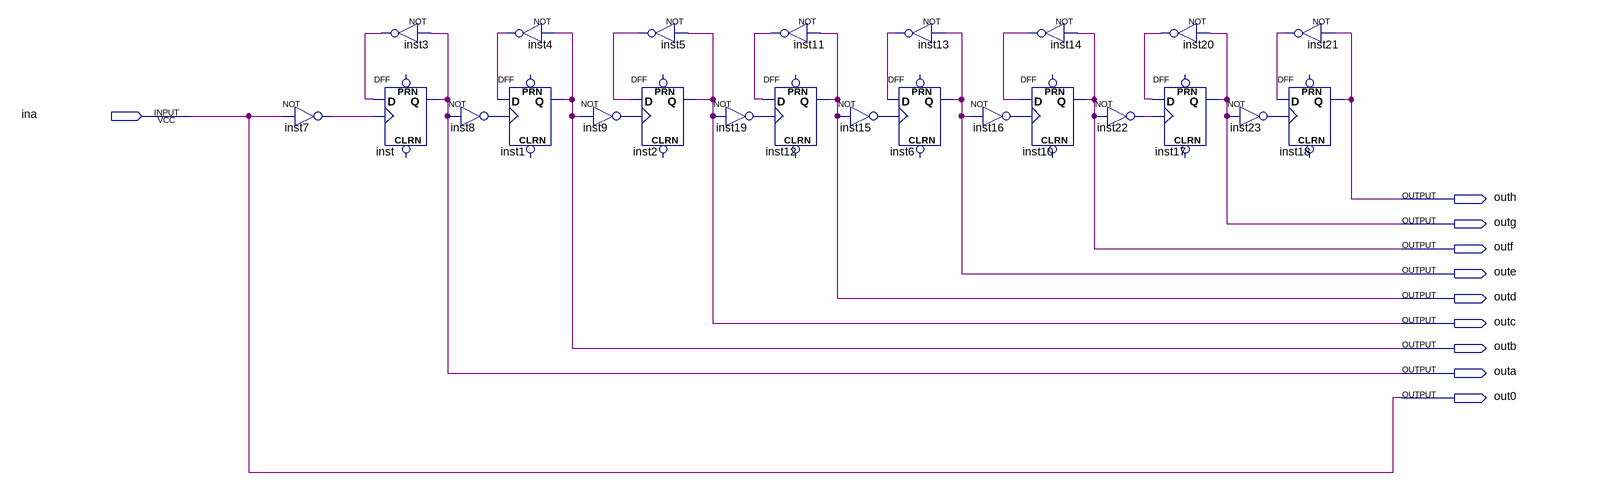
[diagram p0: schematic sheet]
// Quartus schematic clock8bit.bdf as structural Verilog: 24 symbols, 10 pins
module clock8bit (
  input  ina,
  output outh,
  output outg,
  output outf,
  output oute,
  output outd,
  output outc,
  output outb,
  output outa,
  output out0
);

  wire inst3_out, inst4_out, inst5_out, inst7_out, inst8_out, inst9_out, inst11_out, inst13_out, inst14_out,
       inst15_out, inst16_out, inst19_out, inst20_out, inst21_out, inst22_out, inst23_out;

  not inst7 (inst7_out, ina);
  not inst3 (inst3_out, outa);
  DFF inst (.CLK(inst7_out), .D(inst3_out), .Q(outa));  // open: CLRN, PRN
  not inst8 (inst8_out, outa);
  not inst4 (inst4_out, outb);
  DFF inst1 (.CLK(inst8_out), .D(inst4_out), .Q(outb));  // open: CLRN, PRN
  not inst9 (inst9_out, outb);
  not inst5 (inst5_out, outc);
  DFF inst2 (.CLK(inst9_out), .D(inst5_out), .Q(outc));  // open: CLRN, PRN
  not inst19 (inst19_out, outc);
  not inst11 (inst11_out, outd);
  DFF inst12 (.CLK(inst19_out), .D(inst11_out), .Q(outd));  // open: CLRN, PRN
  not inst15 (inst15_out, outd);
  not inst13 (inst13_out, oute);
  DFF inst6 (.CLK(inst15_out), .D(inst13_out), .Q(oute));  // open: CLRN, PRN
  not inst16 (inst16_out, oute);
  not inst14 (inst14_out, outf);
  DFF inst10 (.CLK(inst16_out), .D(inst14_out), .Q(outf));  // open: CLRN, PRN
  not inst22 (inst22_out, outf);
  not inst20 (inst20_out, outg);
  DFF inst17 (.CLK(inst22_out), .D(inst20_out), .Q(outg));  // open: CLRN, PRN
  not inst23 (inst23_out, outg);
  not inst21 (inst21_out, outh);
  DFF inst18 (.CLK(inst23_out), .D(inst21_out), .Q(outh));  // open: CLRN, PRN

  assign out0 = ina;
endmodule
